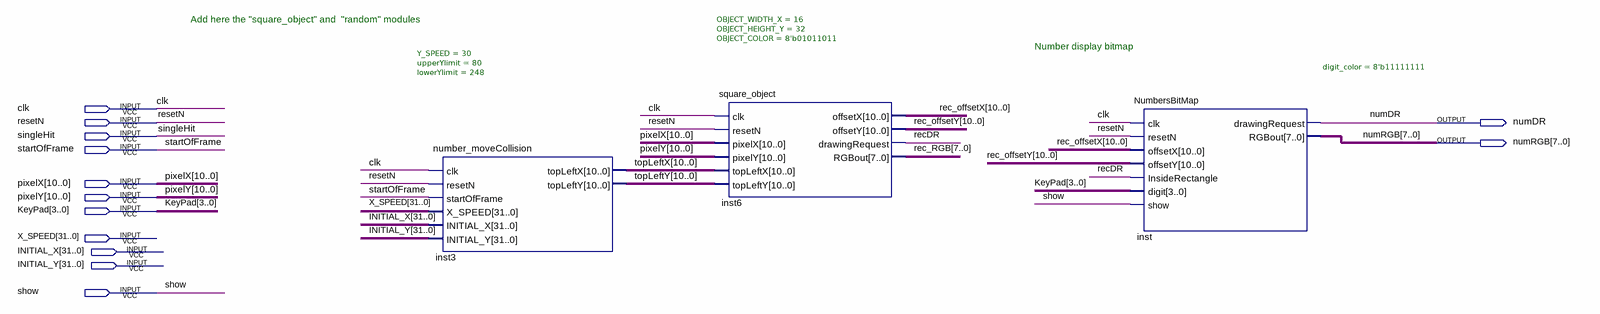
[diagram p0: schematic sheet]
// Quartus schematic NUMBER_DISPLAY.bdf as structural Verilog: 3 symbols, 13 pins
module NUMBER_DISPLAY (
  input  clk,
  input  resetN,
  input  singleHit,
  input  startOfFrame,
  input  [10:0] pixelX,
  input  [10:0] pixelY,
  input  [3:0] KeyPad,
  input  [31:0] X_SPEED,
  input  [31:0] INITIAL_X,
  input  [31:0] INITIAL_Y,
  input  show,
  output numDR,
  output [7:0] numRGB
);

  wire recDR;
  wire [7:0] rec_RGB;
  wire [10:0] rec_offsetX, rec_offsetY, topLeftX, topLeftY;

  number_moveCollision #(.Y_SPEED(30), .upperYlimit(80), .lowerYlimit(248)) inst3 (
    .clk(clk), .resetN(resetN), .startOfFrame(startOfFrame), .X_SPEED(X_SPEED), .INITIAL_X(INITIAL_X),
    .INITIAL_Y(INITIAL_Y), .topLeftX(topLeftX), .topLeftY(topLeftY));
  square_object #(.OBJECT_WIDTH_X(16), .OBJECT_HEIGHT_Y(32), .OBJECT_COLOR(8'b01011011)) inst6 (
    .clk(clk), .resetN(resetN), .pixelX(pixelX), .pixelY(pixelY), .topLeftX(topLeftX), .topLeftY(topLeftY),
    .offsetX(rec_offsetX), .offsetY(rec_offsetY), .drawingRequest(recDR), .RGBout(rec_RGB));
  NumbersBitMap #(.digit_color(8'b11111111)) inst (
    .clk(clk), .resetN(resetN), .offsetX(rec_offsetX), .offsetY(rec_offsetY), .InsideRectangle(recDR),
    .digit(KeyPad), .show(show), .drawingRequest(numDR), .RGBout(numRGB));

  // Notes on the sheet:
  //   Add here the "square_object" and  "random" modules
  //   Number display bitmap
endmodule
